# Altium schematic sheet Acquisition-System_HMI_V1.0.SchDoc: Acquisition-System
size A4; PageSetup: Record=PageOptions|CenterHorizontal=True|CenterVertical=True|PrintScale=0.97|XCorrection=1.00|YCorrection=1.00|PrintKind=0|BorderSize=5000000|LeftOffset=0|BottomOffset=0|Orientation=2|PaperLength=1000|PaperWidth=1000|Scale=100|PaperSource=7|PrintQuality=-3|MediaType=1|DitherType=10|PrintScaleMode=1|PaperKind=A4|PaperIndex=9; Organization: Ostschweizer Fachhochschule; Address2: Florian Baumgartner & Thierry Schwaller; Address3: florian.baumgartner@ost.ch; DocumentNumber: 5; Revision: V1.0; SheetNumber: 5; SheetTotal: 5; Author: Florian Baumgartner & Alain Keller; Subtitle: HMI
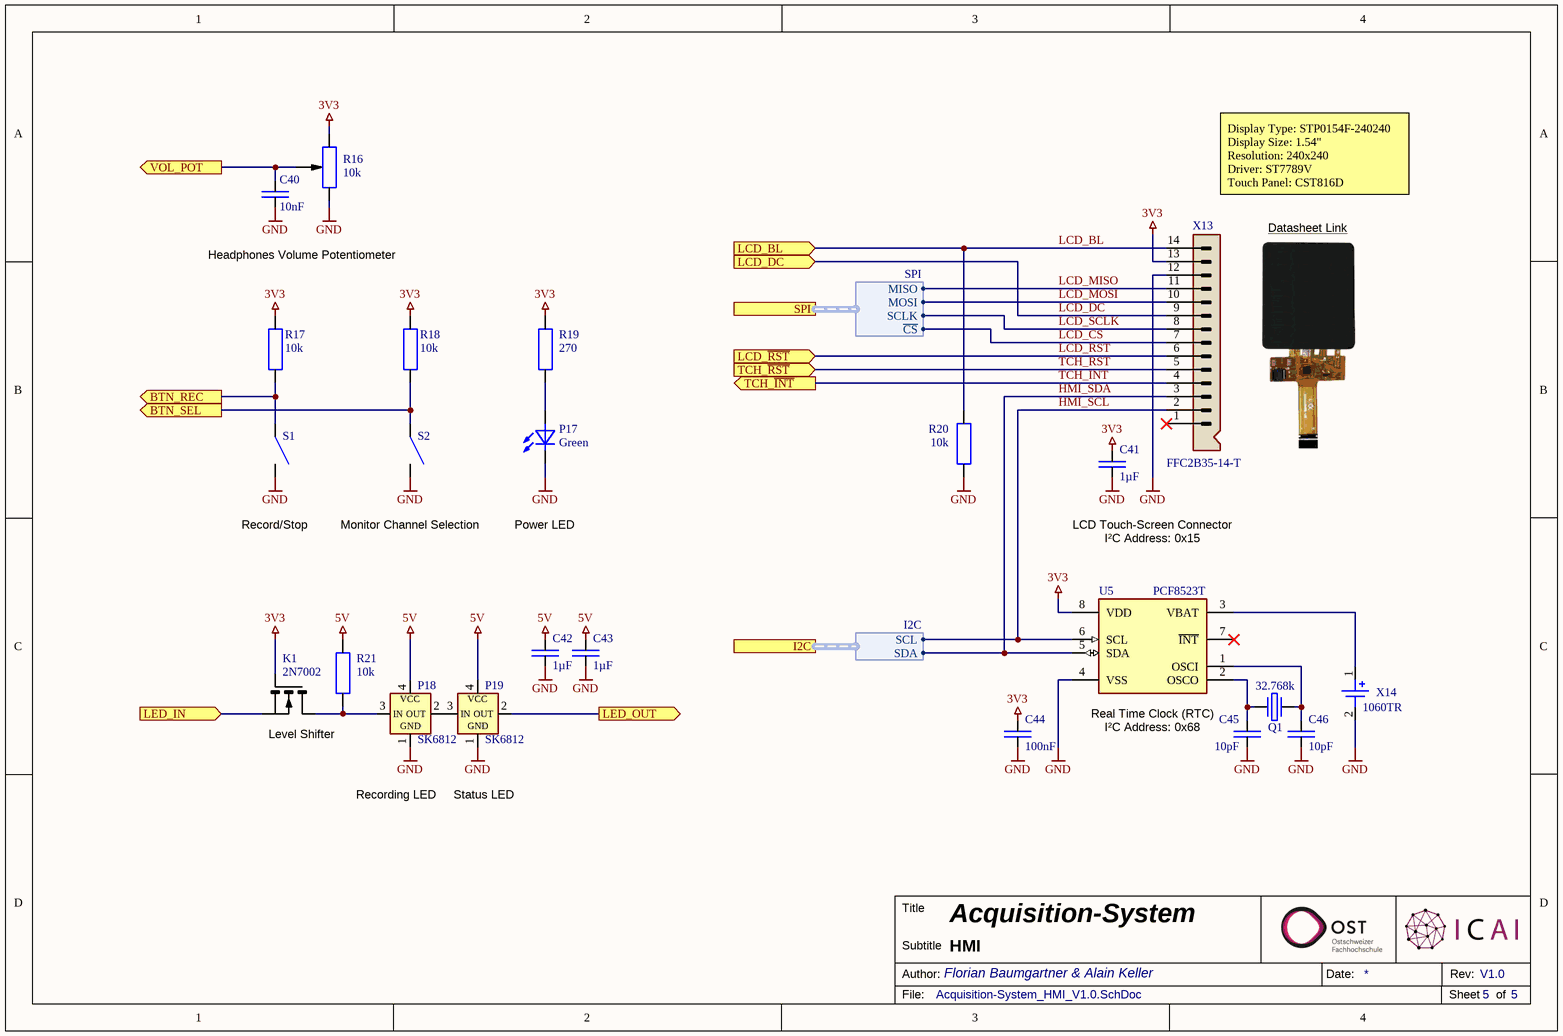
[diagram p0: Acquisition-System_HMI_V1.0.SchDoc]

## Parts
C40  10nF  [SMD Keramikkondensator 0603]
C41  1µF  [SMD Keramikkondensator 0603]
C42  1µF  [SMD Keramikkondensator 0603]
C43  1µF  [SMD Keramikkondensator 0603]
C44  100nF  [SMD Keramikkondensator 0603]
C45  10pF  [SMD Keramikkondensator 0603]
C46  10pF  [SMD Keramikkondensator 0603]
K1  2N7002  [SMD MOSFET SOT-23]
P17  Green  [SMD LED 0603]
P18  SK6812  [SMD LED WS2812B-3528]
P19  SK6812  [SMD LED WS2812B-3528]
Q1  32.768k
R16  10k  [THT Potentiometer (RK09D1130C2P)]
R17  10k  [SMD Widerstand 0603]
R18  10k  [SMD Widerstand 0603]
R19  270  [SMD Widerstand 0603]
R20  10k  [SMD Widerstand 0603]
R21  10k  [SMD Widerstand 0603]
S1  SMD-Button  [SMD Button 4.2x3.2x2.5]  (value not drawn)
S2  SMD-Button  [SMD Button 4.2x3.2x2.5]  (value not drawn)
U5  PCF8523T  [SMD IC TO-263-5]
X13  FFC2B35-14-T  [THT Pin-Header 1x6 (NP)]
X14  1060TR  [SMD Battery-Holder (1048P)]

## Ports
BTN_REC (out), BTN_SEL (out), I2C (harness I2C), LCD_BL (in), LCD_DC (in), LCD_~{RST} (in), LED_IN (in), LED_OUT (out), SPI (harness SPI), TCH_~{INT} (out), TCH_~{RST} (in), VOL_POT (out)

## Harnesses
I2C: SCL, SDA
SPI: SCLK, MOSI, ~{CS}, MISO

## Nets
3V3: C41.2 C44.2 K1.G R16.CCW R17.2 R18.2 R19.1 U5.8(VDD) X13.13
5V: C42.2 C43.2 P18.4(VCC) P19.4(VCC) R21.2
GND: C40.1 C41.1 C42.1 C43.1 C44.1 C45.2 C46.2 P17.K P18.1(GND) P19.1(GND) R16.CW R20.1 S1.2 S2.2 U5.4(VSS) X13.12 X14.2(N)
BTN_REC: R17.1 S1.1 ; port BTN_REC
BTN_SEL: R18.1 S2.1 ; port BTN_SEL
HMI_SCL: U5.6(SCL) X13.2 ; port I2C.SCL
HMI_SDA: U5.5(SDA) X13.3 ; port I2C.SDA
LCD_BL: R20.2 X13.14 ; port LCD_BL
LCD_~{CS}: X13.7 ; port SPI.~{CS}
LCD_DC: X13.9 ; port LCD_DC
LCD_MISO: X13.11 ; port SPI.MISO
LCD_MOSI: X13.10 ; port SPI.MOSI
LCD_~{RST}: X13.6 ; port LCD_~{RST}
LCD_SCLK: X13.8 ; port SPI.SCLK
LED_IN: K1.S ; port LED_IN
LED_OUT: P19.2(OUT) ; port LED_OUT
TCH_~{INT}: X13.4 ; port TCH_~{INT}
TCH_~{RST}: X13.5 ; port TCH_~{RST}
VOL_POT: C40.2 R16.M ; port VOL_POT
NetC45_1: C45.1 Q1.1 U5.2(OSCO)
NetC46_1: C46.1 Q1.2 U5.1(OSCI)
NetK1_D: K1.D P18.3(IN) R21.1
NetP17_A: P17.A R19.2
NetP18_2: P18.2(OUT) P19.3(IN)
NetU5_3: U5.3(VBAT) X14.1(P)

Not connected (* = marked no-connect by the designer): U5 7(~{INT})* 9(NC) 10(NC) 11(NC); X13 1*

## Notes on the sheet
- Headphones Volume Potentiometer
- Display Type: STP0154F-240240
  Display Size: 1.54"
  Resolution: 240x240
  Driver: ST7789V
  Touch Panel: CST816D
- Datasheet Link <http://surenoo.tech/download/04_STP/0154/STP0154F-240240.pdf>
- Record/Stop
- Monitor Channel Selection
- Power LED
- LCD Touch-Screen Connector
- I²C Address: 0x15
- Real Time Clock (RTC)
- (near K1) Level Shifter
- Recording LED
- Status LED
- I²C Address: 0x68
- Title
- Author:
- Subtitle
- Date:
- Rev:
- File:
- Sheet
- of

## Library data of the parts
C40 = C-CAPACITOR: CAP-MK; Component Description: Multilayer Ceramic Capacitors; Component Value: 10nF 50V; Digikey: 445-5662-1-ND; Farnell: 2346966; Mouser: 77-VJ0603V103ZXAPBC; JLC-Parts: C57112; Unit Price: 0.01
C41-C43 = C-CAPACITOR: CAP-MK; Component Description: Multilayer Ceramic Capacitors; Component Value: 1µF 50V; Digikey: 1276-1860-1-ND; Farnell: 3013383; Mouser: 187-CL10A105KB8NNNC; JLC-Parts: C15849; Unit Price: 0.01
C44 = E6 - 100nF: SMD Ceramic Capacitor E6; Component Value: 100nF 50V; Component Description: Multilayer Ceramic Capacitors MLCC; ComponentLink1Description: Datasheet; ComponentLink1URL: https://datasheet.lcsc.com/lcsc/1809301912_YAGEO-CC0603KRX7R9BB104_C14663.pdf; Digikey: 445-6899-1-ND; Farnell: 2210822; JLC-Parts: C14663; Mouser: 810-CGA2B3X7R1H104K; Unit Price: 0.01
C45 C46 = C-CAPACITOR: CAP-MK; Component Description: Multilayer Ceramic Capacitors; Component Value: 10pF 50V; Digikey: 399-C0603C100J5GAC7867CT-ND; Farnell: 1414601; Mouser: 80-C0603C100J5G; JLC-Parts: C1634; Unit Price: 0.01
K1 = K-FET:NIGE: MOSFET N-Channel; Digikey: 2N7002NCT-ND; Farnell: 1713823; Mouser: 512-2N7002; ComponentLink1Description: Datasheet; ComponentLink1URL: https://datasheet.lcsc.com/lcsc/1810151612_Jiangsu-Changjing-Electronics-Technology-Co---Ltd--2N7002_C8545.pdf; Component Description: MOSFET N-Channel; Component Value: 2N7002; JLC-Parts: C8545; Unit Price: 0.02
P17 = LED Green 0603: General Purpose LED; Component Value: Green (5mA, 2.4V); Digikey: 350-2035-1-ND; Farnell: 1465991; Mouser: 645-598-8070-107F; Unit Price: 0.34; ComponentLink1Description: Datasheet; ComponentLink1URL: https://datasheet.lcsc.com/szlcsc/Everlight-Elec-19-217-GHC-YR1S2-3T_C72043.pdf; JLC-Parts: C72043; Component Description: General Purpose LED
P18 P19 = P-SK6812D-EC3210R: Smart RGB-LED; aliExpress: 1005003125851992; Digikey: 1528-4893-ND; Mouser: 485-4893; JLC-Parts: C2890041; ComponentLink1Description: Datasheet; ComponentLink1URL: https://datasheet.lcsc.com/lcsc/2108251530_OPSCO-Optoelectronics-SK6812D-EC3210R_C2890041.pdf; Component Description: Smart RGB-LED; Component Value: SK6812D-EC3210R; Unit Price: 0.12
Q1 = Q-Crystal: Component Value: 32.768kHz; Digikey: SER4103CT-ND; Mouser: 732-532.7680KA-A5; Component Description: Crystal; ComponentLink1Description: Datasheet; ComponentLink1URL: https://datasheet.lcsc.com/lcsc/1810171817_Seiko-Epson-Q13FC1350000400_C32346.pdf; JLC-Parts: C32346; Unit Price: 0.18
R16 = R-RES:VAR: RES-VAR; Component Description: Potentiometer; Component Value: RK10J11R0A0H (Dual 10k); ComponentLink1Description: Datasheet; ComponentLink1URL: https://docs.rs-online.com/6334/A700000006802142.pdf; JLC-Parts: C470766; Mouser: 688-RK10J11R0A0H; Unit Price: 0.60
R17 R18 R20 R21 = R-RESISTOR: RES (E=Heizwiderstand B=Messwandler); Component Description: Thick Film Chip Resistor; Component Value: 10k (75V, 100mW, 1%); Digikey: P10.0KHCT-ND; Farnell: 2303192; Mouser: 667-ERJ-3EKF1002V; JLC-Parts: C25804; Unit Price: 0.01
R19 = R-RESISTOR: SMD-Widerstand 1/4W; Component Description: Thick Film Chip Resistor; Component Value: 270 (75V, 100mW, 1%); Digikey: P270HCT-ND; Farnell: 2303096; Mouser: 667-ERJ-3EKF2700V; JLC-Parts: C22966; Unit Price: 0.06
S1 S2 = Button 3mmx2.5mm: Button SPST; Component Value: SKRPACE010; Component Description: Tactile Switch; Digikey: 4809-SKRPACE010CT-ND; ComponentLink1Description: Datasheet; ComponentLink1URL: https://datasheet.lcsc.com/lcsc/1811051610_ALPSALPINE-SKRPACE010_C139797.pdf; Farnell: 3261825; JLC-Parts: C139797; Mouser: 688-SKRPACE010; Unit Price: 0.04
U5 = U-PCF8523T: Real-Time Clock (RTC) and Calendar; Component Value: PCF8523T/1,118; ComponentLink1Description: Datasheet; ComponentLink1URL: https://www.nxp.com/docs/en/data-sheet/PCF8523.pdf; Digikey: 568-5306-1-ND; Farnell: 2400452; JLC-Parts: C2651516; Mouser: 771-PCF8523T/1118; Unit Price: 1.35; Component Description: Real-Time Clock (RTC) and Calendar
X13 = X-FPC-Connector (14-Pin): FPC-Connector (14-Pin, Front Flip,  Bottom Contact); Digikey: 2073-FFC2B35-14-TDKR-ND; Farnell: 3933420; Mouser: 640-FFC2B35-14-T; Component Description: FPC-Connector (14-Pin, Front Flip,  Bottom Contact); Component Value: FFC2B35-14-T; JLC-Parts: C262663; Unit Price: 0.09; ComponentLink2Description: Datasheet; ComponentLink2URL: https://gct.co/files/drawings/ffc2b35.pdf
X14 = X-CR2032-Battery-Holder: Battery Holder (CR2032); Component Value: 1060TR; Digikey: 36-1060CT-ND; Farnell: 2533470; Mouser: 534-1060TR; Unit Price: 0.25; ComponentLink1Description: Datasheet; ComponentLink1URL: https://datasheet.lcsc.com/lcsc/2012181808_MYOUNG-BS-06-B4AA002_C964756.pdf; JLC-Parts: C964756; Component Description: Battery Holder (CR2032)